# Altium schematic sheet uController.SchDoc
size A3; SheetNumber: 2; SheetTotal: 6
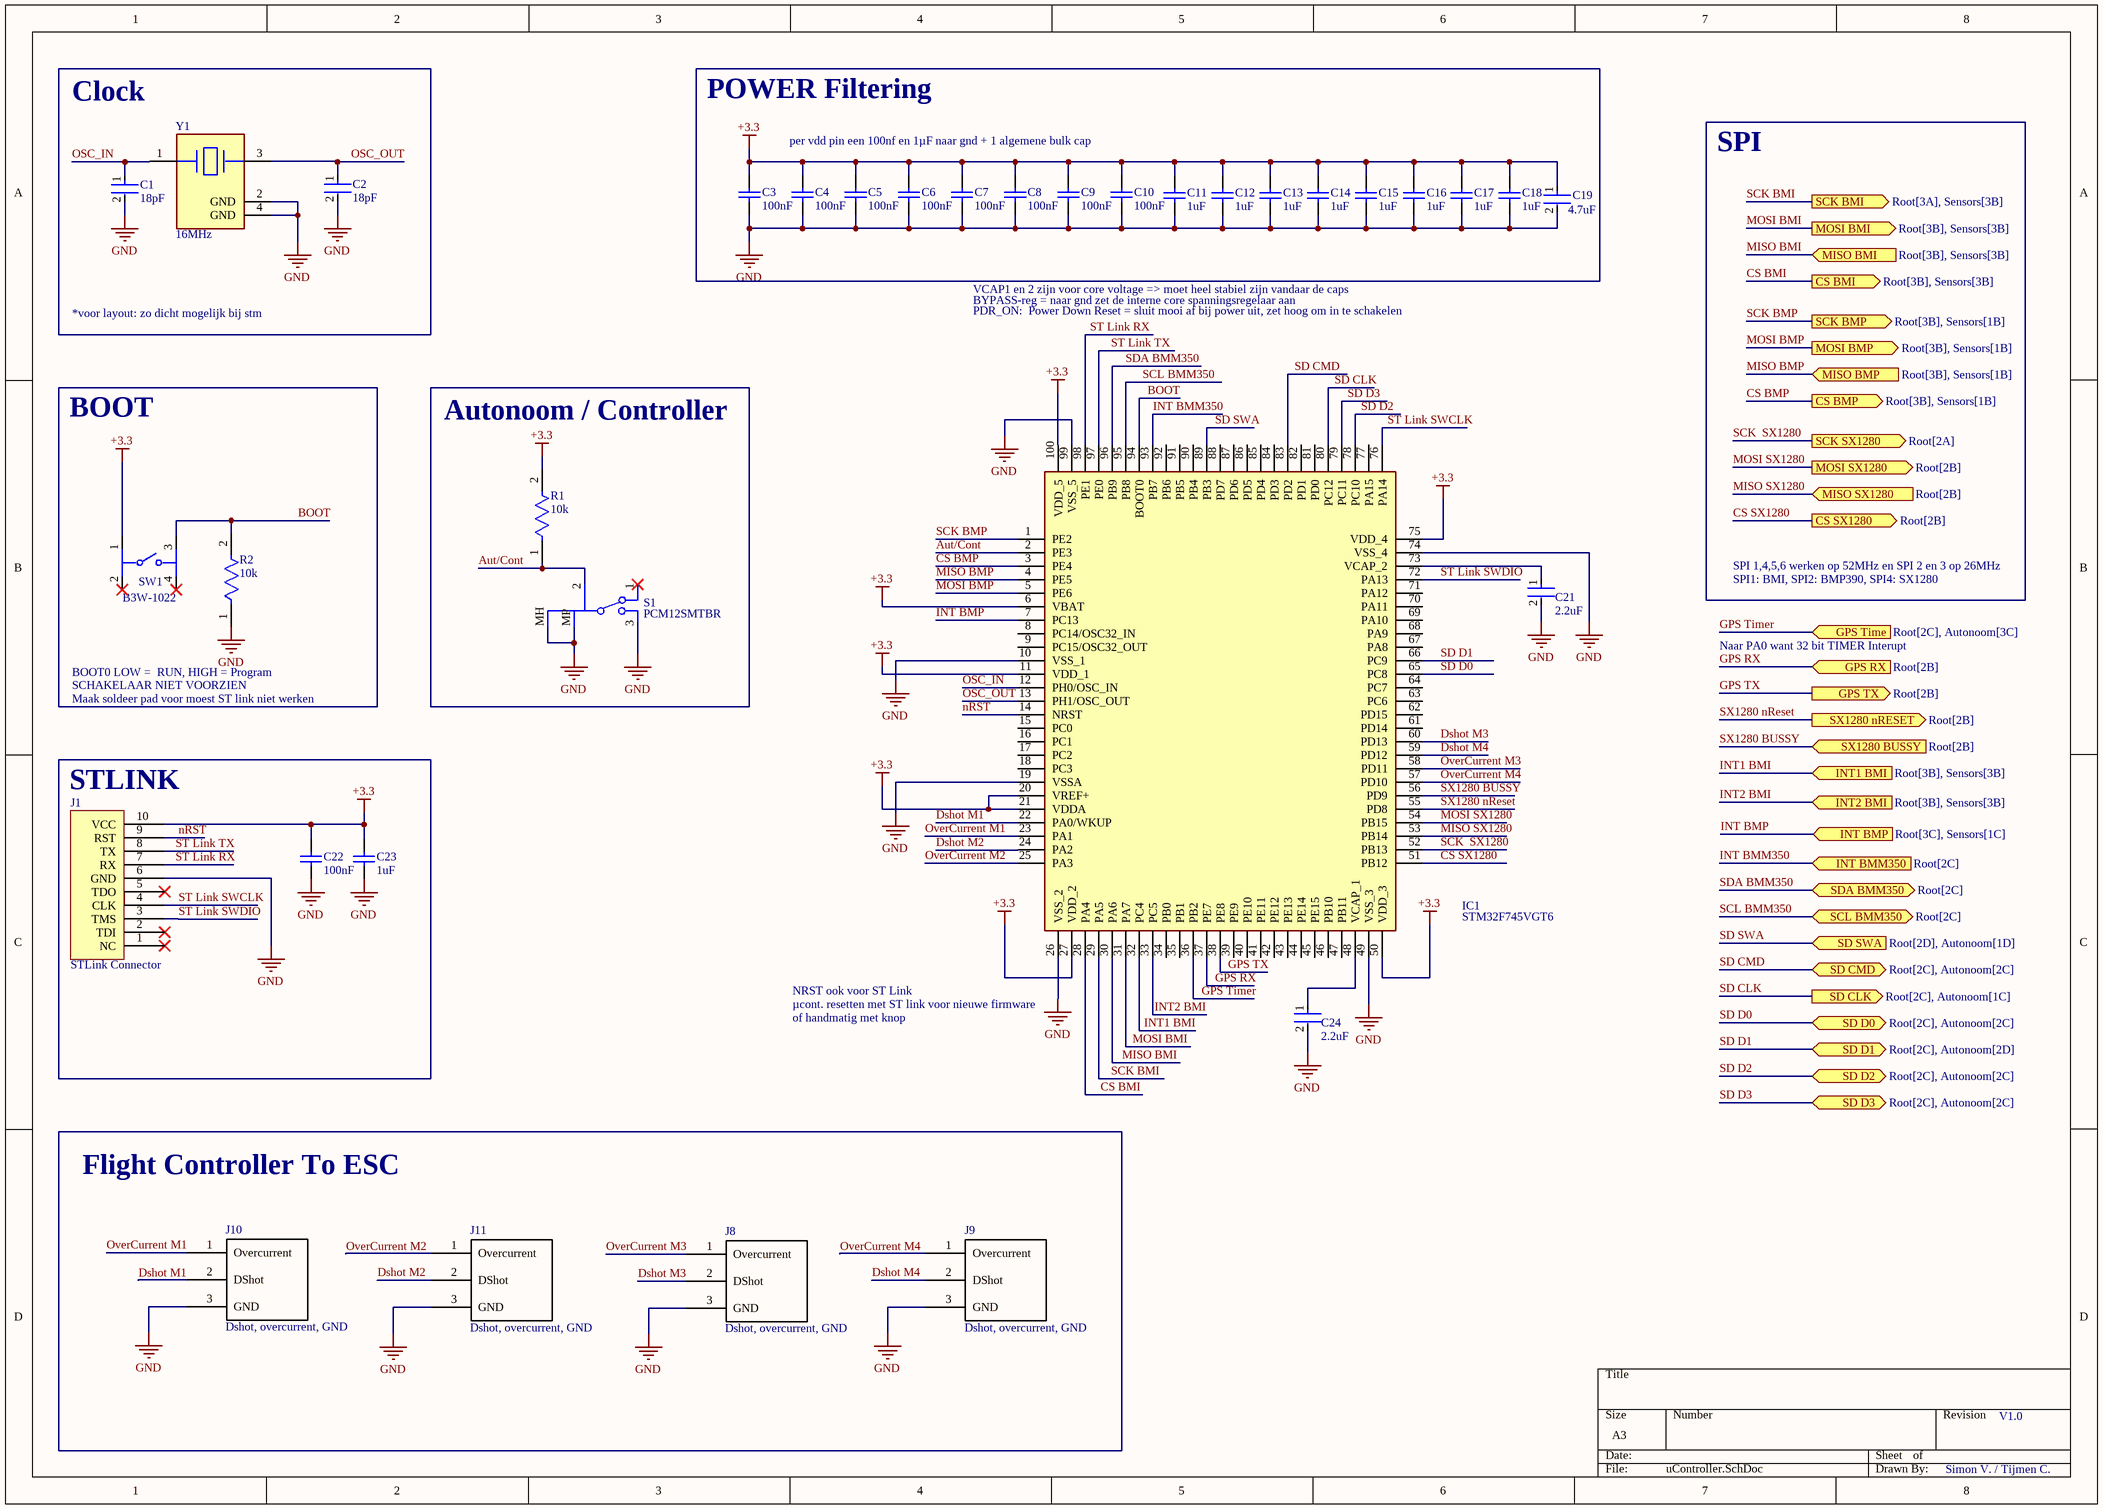
[diagram p0: uController.SchDoc]

## Parts
C1  18pF  [FP-C0603C-CF-MFG]
C2  18pF  [FP-C0603C-CF-MFG]
C3  100nF  [CAPC1608X92X38ML15T08]
C4  100nF  [CAPC1608X92X38ML15T08]
C5  100nF  [CAPC1608X92X38ML15T08]
C6  100nF  [CAPC1608X92X38ML15T08]
C7  100nF  [CAPC1608X92X38ML15T08]
C8  100nF  [CAPC1608X92X38ML15T08]
C9  100nF  [CAPC1608X92X38ML15T08]
C10  100nF  [CAPC1608X92X38ML15T08]
C11  1uF  [CAPC1608X90X35NL15T15]
C12  1uF  [CAPC1608X90X35NL15T15]
C13  1uF  [CAPC1608X90X35NL15T15]
C14  1uF  [CAPC1608X90X35NL15T15]
C15  1uF  [CAPC1608X90X35NL15T15]
C16  1uF  [CAPC1608X90X35NL15T15]
C17  1uF  [CAPC1608X90X35NL15T15]
C18  1uF  [CAPC1608X90X35NL15T15]
C19  4.7uF  [FP-CC0603-DC-MFG]
C21  2.2uF  [FP-CC0603-DA-MFG]
C22  100nF  [CAPC1608X92X38ML15T08]
C23  1uF  [CAPC1608X90X35NL15T15]
C24  2.2uF  [FP-CC0603-DA-MFG]
IC1  STM32F745VGT6  [QFP50P1600X1600X160-100N]
J1  STLink Connector  [PCBComponent_1]
J8  Dshot, overcurrent, GND  [FC-ESC_Connector]
J9  Dshot, overcurrent, GND  [FC-ESC_Connector]
J10  Dshot, overcurrent, GND  [FC-ESC_Connector]
J11  Dshot, overcurrent, GND  [FC-ESC_Connector]
R1  10k  [FP-MCT0603-MFG]
R2  10k  [FP-MCT0603-MFG]
S1  PCM12SMTBR  [PCM12SMTBR]
SW1  B3W-1022  [FP-B3W-1022-MFG]
Y1  16MHz  [FP-ABM8-MFG]

## Ports
CS BMI (out, see Root[3B], Sensors[3B]), CS BMP (out, see Root[3B], Sensors[1B]), CS SX1280 (out, see Root[2B]), GPS RX (in, see Root[2B]), GPS Time (in, see Root[2C], Autonoom[3C]), GPS TX (out, see Root[2B]), INT1 BMI (in, see Root[3B], Sensors[3B]), INT2 BMI (in, see Root[3B], Sensors[3B]), INT BMM350 (in, see Root[2C]), INT BMP (in, see Root[3C], Sensors[1C]), MISO BMI (in, see Root[3B], Sensors[3B]), MISO BMP (in, see Root[3B], Sensors[1B]), MISO SX1280 (in, see Root[2B]), MOSI BMI (out, see Root[3B], Sensors[3B]), MOSI BMP (out, see Root[3B], Sensors[1B]), MOSI SX1280 (out, see Root[2B]), SCK BMI (out, see Root[3A], Sensors[3B]), SCK BMP (out, see Root[3B], Sensors[1B]), SCK SX1280 (out, see Root[2A]), SCL BMM350 (bidir, see Root[2C]), SD CLK (out, see Root[2C], Autonoom[1C]), SD CMD (bidir, see Root[2C], Autonoom[2C]), SD D0 (bidir, see Root[2C], Autonoom[2C]), SD D1 (bidir, see Root[2C], Autonoom[2D]), SD D2 (bidir, see Root[2C], Autonoom[2C]), SD D3 (bidir, see Root[2C], Autonoom[2C]), SD SWA (in, see Root[2D], Autonoom[1D]), SDA BMM350 (bidir, see Root[2C]), SX1280 BUSSY (in, see Root[2B]), SX1280 nRESET (out, see Root[2B])

## Nets
+3.3: C3.2 C4.2 C5.2 C6.2 C7.2 C8.2 C9.2 C10.2 C11.2 C12.2 C13.2 C14.2 C15.2 C16.2 C17.2 C18.2 C19.1 C22.2 C23.2 IC1.6(VBAT) IC1.11(VDD_1) IC1.20(VREF+) IC1.21(VDDA) IC1.27(VDD_2) IC1.50(VDD_3) IC1.75(VDD_4) IC1.100(VDD_5) J1.10(VCC) R1.2 SW1.1
GND: C1.2 C2.2 C3.1 C4.1 C5.1 C6.1 C7.1 C8.1 C9.1 C10.1 C11.1 C12.1 C13.1 C14.1 C15.1 C16.1 C17.1 C18.1 C19.2 C21.2 C22.1 C23.1 C24.2 IC1.10(VSS_1) IC1.19(VSSA) IC1.26(VSS_2) IC1.49(VSS_3) IC1.74(VSS_4) IC1.99(VSS_5) J1.6(GND) J8.3(GND) J9.3(GND) J10.3(GND) J11.3(GND) R2.1 S1.3 S1.MH(MP) S1.MP Y1.2(GND) Y1.4(GND)
Aut/Cont: IC1.2(PE3) R1.1 S1.2
BOOT: IC1.94(BOOT0) R2.2 SW1.3
CS BMI: IC1.28(PA4) ; port CS BMI
CS BMP: IC1.3(PE4) ; port CS BMP
CS SX1280: IC1.51(PB12) ; port CS SX1280
Dshot M1: IC1.22(PA0/WKUP) J10.2(DShot)
Dshot M2: IC1.24(PA2) J11.2(DShot)
Dshot M3: IC1.60(PD13) J8.2(DShot)
Dshot M4: IC1.59(PD12) J9.2(DShot)
GPS RX: IC1.37(PE7) ; port GPS RX
GPS Timer: IC1.36(PB2) ; port GPS Time
GPS TX: IC1.38(PE8) ; port GPS TX
INT1 BMI: IC1.32(PC4) ; port INT1 BMI
INT2 BMI: IC1.33(PC5) ; port INT2 BMI
INT BMM350: IC1.93(PB7) ; port INT BMM350
INT BMP: IC1.7(PC13) ; port INT BMP
MISO BMI: IC1.30(PA6) ; port MISO BMI
MISO BMP: IC1.4(PE5) ; port MISO BMP
MISO SX1280: IC1.53(PB14) ; port MISO SX1280
MOSI BMI: IC1.31(PA7) ; port MOSI BMI
MOSI BMP: IC1.5(PE6) ; port MOSI BMP
MOSI SX1280: IC1.54(PB15) ; port MOSI SX1280
nRST: IC1.14(NRST) J1.9(RST)
OSC_IN: C1.1 IC1.12(PH0/OSC_IN) Y1.1
OSC_OUT: C2.1 IC1.13(PH1/OSC_OUT) Y1.3
OverCurrent M1: IC1.23(PA1) J10.1(Overcurrent)
OverCurrent M2: IC1.25(PA3) J11.1(Overcurrent)
OverCurrent M3: IC1.58(PD11) J8.1(Overcurrent)
OverCurrent M4: IC1.57(PD10) J9.1(Overcurrent)
SCK  SX1280: IC1.52(PB13) ; port SCK SX1280
SCK BMI: IC1.29(PA5) ; port SCK BMI
SCK BMP: IC1.1(PE2) ; port SCK BMP
SCL BMM350: IC1.95(PB8) ; port SCL BMM350
SD CLK: IC1.80(PC12) ; port SD CLK
SD CMD: IC1.83(PD2) ; port SD CMD
SD D0: IC1.65(PC8) ; port SD D0
SD D1: IC1.66(PC9) ; port SD D1
SD D2: IC1.78(PC10) ; port SD D2
SD D3: IC1.79(PC11) ; port SD D3
SD SWA: IC1.89(PB3) ; port SD SWA
SDA BMM350: IC1.96(PB9) ; port SDA BMM350
ST Link RX: IC1.98(PE1) J1.7(RX)
ST Link SWCLK: IC1.76(PA14) J1.4(CLK)
ST Link SWDIO: IC1.72(PA13) J1.3(TMS)
ST Link TX: IC1.97(PE0) J1.8(TX)
SX1280 BUSSY: IC1.56(PD9) ; port SX1280 BUSSY
SX1280 nReset: IC1.55(PD8) ; port SX1280 nRESET
NetC21_1: C21.1 IC1.73(VCAP_2)
NetC24_1: C24.1 IC1.48(VCAP_1)

Not connected (* = marked no-connect by the designer): IC1 8(PC14/OSC32_IN) 9(PC15/OSC32_OUT) 15(PC0) 16(PC1) 17(PC2) 18(PC3) 34(PB0) 35(PB1) 39(PE9) 40(PE10) 41(PE11) 42(PE12) 43(PE13) 44(PE14) 45(PE15) 46(PB10) 47(PB11) 61(PD14) 62(PD15) 63(PC6) 64(PC7) 67(PA8) 68(PA9) 69(PA10) 70(PA11) 71(PA12) 77(PA15) 81(PD0) 82(PD1) 84(PD3) 85(PD4) 86(PD5) 87(PD6) 88(PD7) 90(PB4) 91(PB5) 92(PB6); J1 1(NC)* 2(TDI)* 5(TDO)*; S1 1*; SW1 2* 4*

## Notes on the sheet
- Clock
- POWER Filtering
- per vdd pin een 100nf en 1µF naar gnd + 1 algemene bulk cap
- SPI
- *voor layout: zo dicht mogelijk bij stm
- VCAP1 en 2 zijn voor core voltage => moet heel stabiel zijn vandaar de caps
- BYPASS-reg = naar gnd zet de interne core spanningsregelaar aan
- PDR_ON:  Power Down Reset = sluit mooi af bij power uit, zet hoog om in te schakelen
- BOOT
- Autonoom / Controller
- SPI1: BMI, SPI2: BMP390, SPI4: SX1280
- SPI 1,4,5,6 werken op 52MHz en SPI 2 en 3 op 26MHz
- Naar PA0 want 32 bit TIMER Interupt
- BOOT0 LOW =  RUN, HIGH = Program
- SCHAKELAAR NIET VOORZIEN
- Maak soldeer pad voor moest ST link niet werken
- (near J1) STLINK
- NRST ook voor ST Link
- µcont. resetten met ST link voor nieuwe firmware
- of handmatig met knop
- Flight Controller To ESC
- V1.0
- Simon V. / Tijmen C.

## Library data of the parts
C1 C2 = CMP-03020-018448-1: C0603 18 pF C0G 30ppm/°C 1.00% 50 V; Manufacturer: KEMET; Manufacturer Part Number: C0603C180F5GACAUTO; Voltage Rating: 50 V; Automotive Grade: Grade 1; Tolerance: 0.01; Material: Ceramic; Height: 0.87mm; Lead Free: Yes; Category: Cap; Capacitance: 18 pF; Temperature Characteristic: C0G; Device Class L3: Ceramic Capacitors; Package: C0603C-CF; ComponentLink2Description: Datasheet; Automotive: Yes; Temperature Range Low: -55°C; Device Class L1: Passive Components; ComponentLink2URL: https://api.kemet.com/component-edge/download/datasheet/C0603C100J5GACAUTO.pdf; Octopart: https://octopart.com/c0603c180f5gacauto-kemet-91893831; Value: 18 pF; Temperature: -55°C to +125°C; Temperature Range High: +125°C; Device Class L2: Capacitors; RoHS: TRUE; Temperature Coefficient: 30ppm/°C
C3-C10 C22 = CMP-2006-01140-1: Part Number: VJ0603Y104MXXAC; Manufacturer: Vitramon
C11-C18 C23 = CMP-2006-04534-1: Part Number: 0603YD105MAT2A; Manufacturer: AVX Interconnect / Elco
C19 = CMP-03422-001038-2: CAP CER 4.7UF 6.3V X7R 0603; Tolerance: 20%; RoHS Compliant: Yes; Packaging: Cut Tape; Mount: Surface Mount; Case Code (Imperial): 0603; Voltage Rating: 6.3V; Min Operating Temperature: -55°C; Case/Package: 0603; Case Code (Metric): 1608; Max Operating Temperature: 125°C; Capacitance: 4.7uF
C21 C24 = CMP-03422-000187-1: CC0603 2.2 uF X5R 10.00% 16 V; Manufacturer: YAGEO; Manufacturer Part Number: CC0603KPX5R7BB225; Voltage Rating: 16 V; Material: Ceramic; Tolerance: 0.1; Temperature Coefficient: 15%; ComponentLink2Description: Datasheet; Device Class L3: Ceramic Capacitors; Temperature Characteristic: X5R; Package: CC0603-DA; Automotive: No; Device Class L1: Passive Components; ComponentLink2URL: http://www.yageo.com/documents/recent/UPY-GPHC_X7R_6.3V-to-50V_18.pdf; Value: 2.2 uF; RoHS: TRUE; Height: 0.9mm; Temperature Range High: +125°C; Footprint Url: http://www.yageo.com/exep/pages/download/literatures/UPY-C_GEN_24.pdf; Lead Free: Yes; Temperature Range Low: -55°C; Capacitance: 2.2 uF; Octopart: https://octopart.com/cc0603kpx5r7bb225-yageo-91091799; Device Class L2: Capacitors; Voltage: 16 V; Temperature: -55°C to +125°C; Category: Cap
IC1 = STM32F745VGT6: Integrated Circuit; Manufacturer_Name: STMicroelectronics; Datasheet Link: https://www.st.com/resource/en/datasheet/stm32f745ie.pdf; Height: 1.6mm; Manufacturer_Part_Number: STM32F745VGT6; Mouser Part Number: 511-STM32F745VGT6; Mouser Price/Stock: https://www.mouser.co.uk/ProductDetail/STMicroelectronics/STM32F745VGT6?qs=k5OWtXsTJapN7FnaCvUsAA%3D%3D; Arrow Part Number: STM32F745VGT6; Arrow Price/Stock: https://www.arrow.com/en/products/stm32f745vgt6/stmicroelectronics
R1 R2 = CMP-02407-002367-1: RES SMD 100 OHM 1% 1/8W 0603; Max Power Dissipation: 100mW; Temperature Coefficient: 15ppm/°C; Resistance: 10kR; Tolerance: 0.1%; Length: 0.061inch; Min Operating Temperature: -55°C; Case/Package: 0603; Max Operating Temperature: 125°C; Number of Terminations: 2; Packaging: Tape and Reel; Width: 0.033inch; Composition: Thin Film; Height: 0.022inch; Package Quantity: 1000
SW1 = CMP-08834-000055-1: SWITCH TACTILE SPST-NO 0.05A 24V; Operating Force: 230gf; Switch Function: Off-Mom; Switch Travel: 0.25mm; Throw Configuration: SPST; Actuator Type: Standard; Illumination Type: Non-Illuminated; Ratings: IP67; Mechanical Life: 1000000Cycles; Packaging: Bulk; Termination: PC Pin; Max Operating Temperature: 70°C; RoHS Compliant: Yes; Mount: Through Hole; Min Operating Temperature: -25°C
Y1 = CMP-27762-003067-1: Crystal 16MHz ±20ppm 18pF SMD-4 3.2mm x 2.5mm                      ABM8-16.000MHZ-B2-T3; Frequency Stability: 50ppm; ESR (Equivalent Series Resistance): 70R; Packaging: Tape and Reel; Load Capacitance: 18pF; Min Operating Temperature: -20°C; Case/Package: SMD/SMT; Length: 0.126inch; RoHS Compliant: Yes; Max Operating Temperature: 70°C; Width: 0.098inch; Series: ABM8; Frequency: 16MHz; Height: 0.031inch; Mount: Surface Mount; Frequency Tolerance: 20ppm